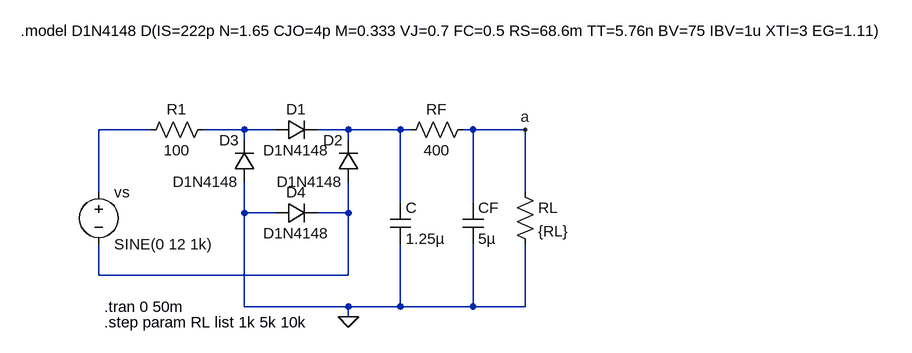
[diagram p0: schematic ej4.1.asc]
ej4.1.asc, the LTspice schematic file:
Version 4.1
SHEET 1 1264 680
WIRE 16 16 -64 16
WIRE 160 16 96 16
WIRE 208 16 160 16
WIRE 320 16 272 16
WIRE 400 16 320 16
WIRE 416 16 400 16
WIRE 512 16 496 16
WIRE 592 16 512 16
WIRE 160 32 160 16
WIRE 320 32 320 16
WIRE -64 112 -64 16
WIRE 592 112 592 16
WIRE 400 128 400 16
WIRE 512 128 512 16
WIRE 160 144 160 96
WIRE 208 144 160 144
WIRE 320 144 320 96
WIRE 320 144 272 144
WIRE -64 240 -64 192
WIRE 320 240 320 144
WIRE 320 240 -64 240
WIRE 160 288 160 144
WIRE 320 288 160 288
WIRE 400 288 400 192
WIRE 400 288 320 288
WIRE 512 288 512 192
WIRE 512 288 400 288
WIRE 592 288 592 192
WIRE 592 288 512 288
WIRE 320 304 320 288
FLAG 592 16 a
FLAG 320 304 0
SYMBOL voltage -64 96 R0
WINDOW 123 0 0 Left 0
WINDOW 39 0 0 Left 0
SYMATTR InstName vs
SYMATTR Value SINE(0 12 1k)
SYMBOL res 112 0 R90
WINDOW 0 0 56 VBottom 2
WINDOW 3 32 56 VTop 2
SYMATTR InstName R1
SYMATTR Value 100
SYMBOL diode 176 96 R180
WINDOW 0 24 64 Left 2
WINDOW 3 24 0 Left 2
SYMATTR InstName D3
SYMATTR Value D1N4148
SYMBOL diode 208 32 R270
WINDOW 0 32 32 VTop 2
WINDOW 3 0 32 VBottom 2
SYMATTR InstName D1
SYMATTR Value D1N4148
SYMBOL diode 336 96 R180
WINDOW 0 24 64 Left 2
WINDOW 3 24 0 Left 2
SYMATTR InstName D2
SYMATTR Value D1N4148
SYMBOL diode 208 160 R270
WINDOW 0 32 32 VTop 2
WINDOW 3 0 32 VBottom 2
SYMATTR InstName D4
SYMATTR Value D1N4148
SYMBOL cap 384 128 R0
SYMATTR InstName C
SYMATTR Value 1.25µ
SYMBOL res 576 96 R0
SYMATTR InstName RL
SYMATTR Value {RL}
SYMBOL cap 496 128 R0
SYMATTR InstName CF
SYMATTR Value 5µ
SYMBOL res 512 0 R90
WINDOW 0 0 56 VBottom 2
WINDOW 3 32 56 VTop 2
SYMATTR InstName RF
SYMATTR Value 400
TEXT -184 -136 Left 2 !.model D1N4148 D(IS=222p N=1.65 CJO=4p M=0.333 VJ=0.7 FC=0.5 RS=68.6m TT=5.76n BV=75 IBV=1u XTI=3 EG=1.11)
TEXT -56 288 Left 2 !.tran 0 50m
TEXT -56 312 Left 2 !.step param RL list 1k 5k 10k

The netlist it stands for:
* ej4.1.asc
vs N001 N004 SINE(0 12 1k)
R1 N002 N001 100
D3 0 N002 D1N4148
D1 N002 N003 D1N4148
D2 N004 N003 D1N4148
D4 0 N004 D1N4148
C N003 0 1.25µ
RL a 0 {RL}
CF a 0 5µ
RF a N003 400
.model D D
.lib standard.dio
.model D1N4148 D(IS=222p N=1.65 CJO=4p M=0.333 VJ=0.7 FC=0.5 RS=68.6m TT=5.76n BV=75 IBV=1u XTI=3 EG=1.11)
.tran 0 50m
.step param RL list 1k 5k 10k
.backanno
.end

* Results of the author's LTspice run, read from the files saved beside the schematic
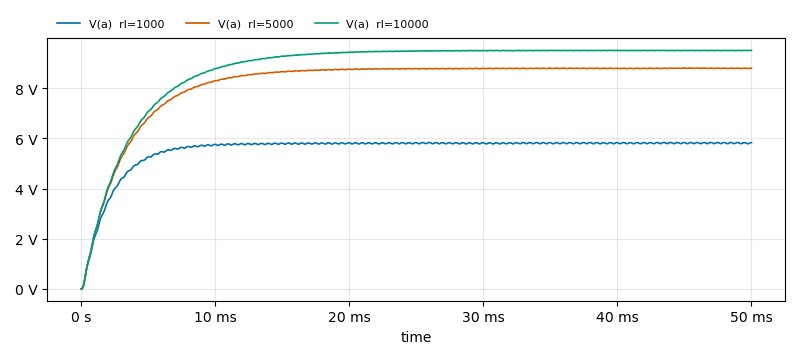
[diagram p1: Transient Analysis of ej4.1.asc, plotted from the saved traces]
* Transient Analysis, 3 runs:
*   V(a) [rl=1000]: min 0 V, max 5.839 V, average 5.551 V, rms 5.615 V, last 5.831 V
*   V(a) [rl=5000]: min 0 V, max 8.809 V, average 8.187 V, rms 8.327 V, last 8.805 V
*   V(a) [rl=10000]: min 0 V, max 9.513 V, average 8.78 V, rms 8.944 V, last 9.513 V